# Altium schematic sheet G11_ProjectLink.SCHDOC
size A4; SheetNumber: 0; SheetTotal: 0
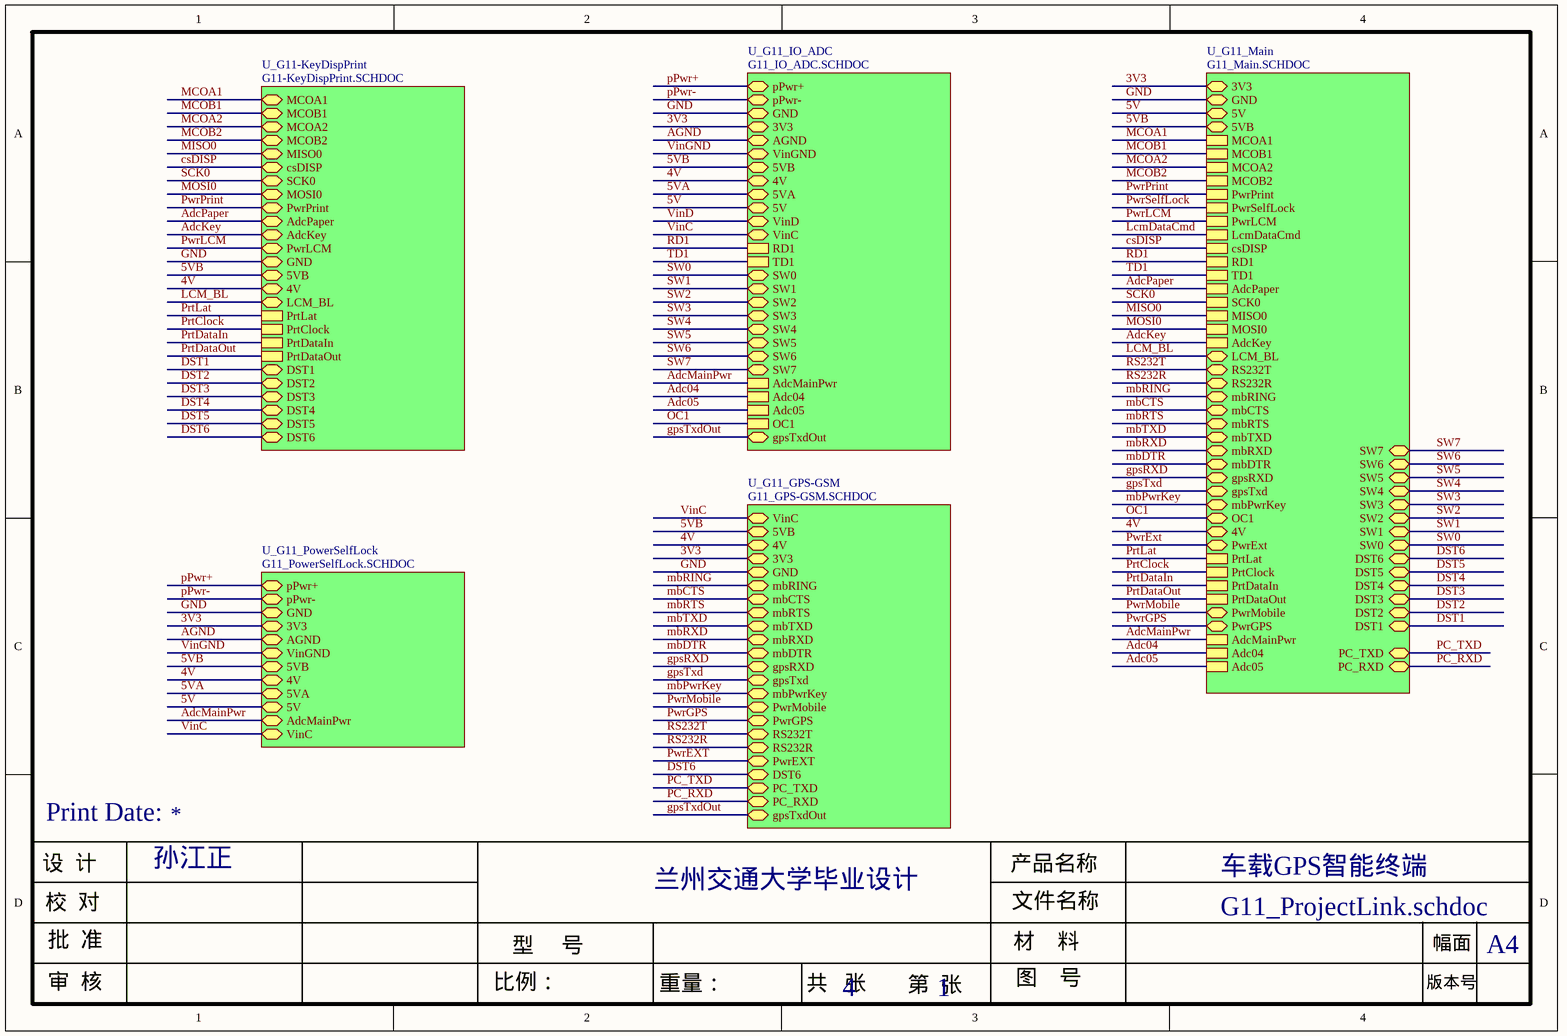
[diagram p0: G11_ProjectLink.SCHDOC]

## Sub-sheets
U_G11-KeyDispPrint = G11-KeyDispPrint.SCHDOC: MCOA1 (bidir), MCOB1 (bidir), MCOA2 (bidir), MCOB2 (bidir), MISO0 (bidir), csDISP (bidir), SCK0 (bidir), MOSI0 (bidir), PwrPrint (bidir), AdcPaper (bidir), AdcKey (bidir), PwrLCM (bidir), GND (bidir), 5VB (bidir), 4V (bidir), LCM_BL (bidir), PrtLat, PrtClock, PrtDataIn, PrtDataOut, DST1 (bidir), DST2 (bidir), DST3 (bidir), DST4 (bidir), DST5 (bidir), DST6 (bidir)
U_G11_GPS-GSM = G11_GPS-GSM.SCHDOC: VinC (bidir), GND (bidir), 5VB (bidir), mbRING (bidir), mbCTS (bidir), mbRTS (bidir), mbTXD (bidir), mbRXD (bidir), mbDTR (bidir), gpsRXD (bidir), gpsTxd (bidir), mbPwrKey (bidir), PwrMobile (bidir), PwrGPS (bidir), RS232T (bidir), RS232R (bidir), 3V3 (bidir), 4V (bidir), PwrEXT (bidir), DST6 (bidir), PC_TXD (bidir), PC_RXD (bidir), gpsTxdOut (bidir)
U_G11_IO_ADC = G11_IO_ADC.SCHDOC: pPwr+ (bidir), pPwr- (bidir), GND (bidir), 3V3 (bidir), AGND (bidir), VinGND (bidir), 5VB (bidir), 4V (bidir), 5VA (bidir), 5V (bidir), VinD (bidir), VinC (bidir), RD1, TD1, SW0 (bidir), SW1 (bidir), SW2 (bidir), SW3 (bidir), SW4 (bidir), SW5 (bidir), SW6 (bidir), SW7 (bidir), AdcMainPwr, Adc04, Adc05, OC1, gpsTxdOut (bidir)
U_G11_Main = G11_Main.SCHDOC: 3V3 (bidir), GND (bidir), 5V (bidir), 5VB (bidir), MCOA1, MCOB1, MCOA2, MCOB2, PwrPrint, PwrSelfLock, PwrLCM, LcmDataCmd, csDISP, RD1, TD1, AdcPaper, SCK0, MISO0, MOSI0, AdcKey, LCM_BL (bidir), RS232T (bidir), RS232R (bidir), mbRING (bidir), mbCTS (bidir), mbRTS (bidir), mbTXD (bidir), mbRXD (bidir), mbDTR (bidir), gpsRXD (bidir), gpsTxd (bidir), mbPwrKey (bidir), OC1 (bidir), 4V (bidir), PwrExt (bidir), PrtLat, PrtClock, PrtDataIn, PrtDataOut, PwrMobile (bidir), PwrGPS (bidir), DST1 (bidir), DST2 (bidir), DST3 (bidir), DST4 (bidir), DST5 (bidir), DST6 (bidir), SW0 (bidir), SW1 (bidir), SW2 (bidir), SW3 (bidir), SW4 (bidir), SW5 (bidir), SW6 (bidir), SW7 (bidir), AdcMainPwr, Adc04, Adc05, PC_TXD (bidir), PC_RXD (bidir)
U_G11_PowerSelfLock = G11_PowerSelfLock.SCHDOC: pPwr+ (bidir), pPwr- (bidir), GND (bidir), 3V3 (bidir), AGND (bidir), VinGND (bidir), 5VB (bidir), 4V (bidir), 5VA (bidir), 5V (bidir), AdcMainPwr (bidir), VinC (bidir)

## Nets
3V3: sheet U_G11_PowerSelfLock/3V3, sheet U_G11_Main/3V3, sheet U_G11_IO_ADC/3V3, sheet U_G11_GPS-GSM/3V3
4V: sheet U_G11_PowerSelfLock/4V, sheet U_G11_Main/4V, sheet U_G11_IO_ADC/4V, sheet U_G11-KeyDispPrint/4V, sheet U_G11_GPS-GSM/4V
5V: sheet U_G11_PowerSelfLock/5V, sheet U_G11_Main/5V, sheet U_G11_IO_ADC/5V
5VA: sheet U_G11_PowerSelfLock/5VA, sheet U_G11_IO_ADC/5VA
5VB: sheet U_G11_PowerSelfLock/5VB, sheet U_G11_Main/5VB, sheet U_G11_IO_ADC/5VB, sheet U_G11-KeyDispPrint/5VB, sheet U_G11_GPS-GSM/5VB
Adc04: sheet U_G11_Main/Adc04, sheet U_G11_IO_ADC/Adc04
Adc05: sheet U_G11_Main/Adc05, sheet U_G11_IO_ADC/Adc05
AdcKey: sheet U_G11_Main/AdcKey, sheet U_G11-KeyDispPrint/AdcKey
AdcMainPwr: sheet U_G11_PowerSelfLock/AdcMainPwr, sheet U_G11_Main/AdcMainPwr, sheet U_G11_IO_ADC/AdcMainPwr
AdcPaper: sheet U_G11_Main/AdcPaper, sheet U_G11-KeyDispPrint/AdcPaper
AGND: sheet U_G11_PowerSelfLock/AGND, sheet U_G11_IO_ADC/AGND
csDISP: sheet U_G11_Main/csDISP, sheet U_G11-KeyDispPrint/csDISP
DST1: sheet U_G11_Main/DST1, sheet U_G11-KeyDispPrint/DST1
DST2: sheet U_G11_Main/DST2, sheet U_G11-KeyDispPrint/DST2
DST3: sheet U_G11_Main/DST3, sheet U_G11-KeyDispPrint/DST3
DST4: sheet U_G11_Main/DST4, sheet U_G11-KeyDispPrint/DST4
DST5: sheet U_G11_Main/DST5, sheet U_G11-KeyDispPrint/DST5
DST6: sheet U_G11_Main/DST6, sheet U_G11-KeyDispPrint/DST6, sheet U_G11_GPS-GSM/DST6
GND: sheet U_G11_PowerSelfLock/GND, sheet U_G11_Main/GND, sheet U_G11_IO_ADC/GND, sheet U_G11-KeyDispPrint/GND, sheet U_G11_GPS-GSM/GND
gpsRXD: sheet U_G11_Main/gpsRXD, sheet U_G11_GPS-GSM/gpsRXD
gpsTxd: sheet U_G11_Main/gpsTxd, sheet U_G11_GPS-GSM/gpsTxd
gpsTxdOut: sheet U_G11_IO_ADC/gpsTxdOut, sheet U_G11_GPS-GSM/gpsTxdOut
LCM_BL: sheet U_G11_Main/LCM_BL, sheet U_G11-KeyDispPrint/LCM_BL
LcmDataCmd: sheet U_G11_Main/LcmDataCmd
mbCTS: sheet U_G11_Main/mbCTS, sheet U_G11_GPS-GSM/mbCTS
mbDTR: sheet U_G11_Main/mbDTR, sheet U_G11_GPS-GSM/mbDTR
mbPwrKey: sheet U_G11_Main/mbPwrKey, sheet U_G11_GPS-GSM/mbPwrKey
mbRING: sheet U_G11_Main/mbRING, sheet U_G11_GPS-GSM/mbRING
mbRTS: sheet U_G11_Main/mbRTS, sheet U_G11_GPS-GSM/mbRTS
mbRXD: sheet U_G11_Main/mbRXD, sheet U_G11_GPS-GSM/mbRXD
mbTXD: sheet U_G11_Main/mbTXD, sheet U_G11_GPS-GSM/mbTXD
MCOA1: sheet U_G11_Main/MCOA1, sheet U_G11-KeyDispPrint/MCOA1
MCOA2: sheet U_G11_Main/MCOA2, sheet U_G11-KeyDispPrint/MCOA2
MCOB1: sheet U_G11_Main/MCOB1, sheet U_G11-KeyDispPrint/MCOB1
MCOB2: sheet U_G11_Main/MCOB2, sheet U_G11-KeyDispPrint/MCOB2
MISO0: sheet U_G11_Main/MISO0, sheet U_G11-KeyDispPrint/MISO0
MOSI0: sheet U_G11_Main/MOSI0, sheet U_G11-KeyDispPrint/MOSI0
OC1: sheet U_G11_Main/OC1, sheet U_G11_IO_ADC/OC1
PC_RXD: sheet U_G11_Main/PC_RXD, sheet U_G11_GPS-GSM/PC_RXD
PC_TXD: sheet U_G11_Main/PC_TXD, sheet U_G11_GPS-GSM/PC_TXD
pPwr+: sheet U_G11_PowerSelfLock/pPwr+, sheet U_G11_IO_ADC/pPwr+
pPwr-: sheet U_G11_PowerSelfLock/pPwr-, sheet U_G11_IO_ADC/pPwr-
PrtClock: sheet U_G11_Main/PrtClock, sheet U_G11-KeyDispPrint/PrtClock
PrtDataIn: sheet U_G11_Main/PrtDataIn, sheet U_G11-KeyDispPrint/PrtDataIn
PrtDataOut: sheet U_G11_Main/PrtDataOut, sheet U_G11-KeyDispPrint/PrtDataOut
PrtLat: sheet U_G11_Main/PrtLat, sheet U_G11-KeyDispPrint/PrtLat
PwrEXT: sheet U_G11_Main/PwrExt, sheet U_G11_GPS-GSM/PwrEXT
PwrGPS: sheet U_G11_Main/PwrGPS, sheet U_G11_GPS-GSM/PwrGPS
PwrLCM: sheet U_G11_Main/PwrLCM, sheet U_G11-KeyDispPrint/PwrLCM
PwrMobile: sheet U_G11_Main/PwrMobile, sheet U_G11_GPS-GSM/PwrMobile
PwrPrint: sheet U_G11_Main/PwrPrint, sheet U_G11-KeyDispPrint/PwrPrint
PwrSelfLock: sheet U_G11_Main/PwrSelfLock
RD1: sheet U_G11_Main/RD1, sheet U_G11_IO_ADC/RD1
RS232R: sheet U_G11_Main/RS232R, sheet U_G11_GPS-GSM/RS232R
RS232T: sheet U_G11_Main/RS232T, sheet U_G11_GPS-GSM/RS232T
SCK0: sheet U_G11_Main/SCK0, sheet U_G11-KeyDispPrint/SCK0
SW0: sheet U_G11_Main/SW0, sheet U_G11_IO_ADC/SW0
SW1: sheet U_G11_Main/SW1, sheet U_G11_IO_ADC/SW1
SW2: sheet U_G11_Main/SW2, sheet U_G11_IO_ADC/SW2
SW3: sheet U_G11_Main/SW3, sheet U_G11_IO_ADC/SW3
SW4: sheet U_G11_Main/SW4, sheet U_G11_IO_ADC/SW4
SW5: sheet U_G11_Main/SW5, sheet U_G11_IO_ADC/SW5
SW6: sheet U_G11_Main/SW6, sheet U_G11_IO_ADC/SW6
SW7: sheet U_G11_Main/SW7, sheet U_G11_IO_ADC/SW7
TD1: sheet U_G11_Main/TD1, sheet U_G11_IO_ADC/TD1
VinC: sheet U_G11_PowerSelfLock/VinC, sheet U_G11_IO_ADC/VinC, sheet U_G11_GPS-GSM/VinC
VinD: sheet U_G11_IO_ADC/VinD
VinGND: sheet U_G11_PowerSelfLock/VinGND, sheet U_G11_IO_ADC/VinGND

## Notes on the sheet
- Print Date:
- 设  计
- 校  对
- 孙江正
- 兰州交通大学毕业设计
- 产品名称
- 文件名称
- G11_ProjectLink.schdoc
- 车载GPS智能终端
- 审  核
- 批  准
- 比例：
- 型     号
- 材    料
- 图    号
- 版本号
- 幅面
- A4
- 重量：
- 共   张
- 4
- 第  张
- 1